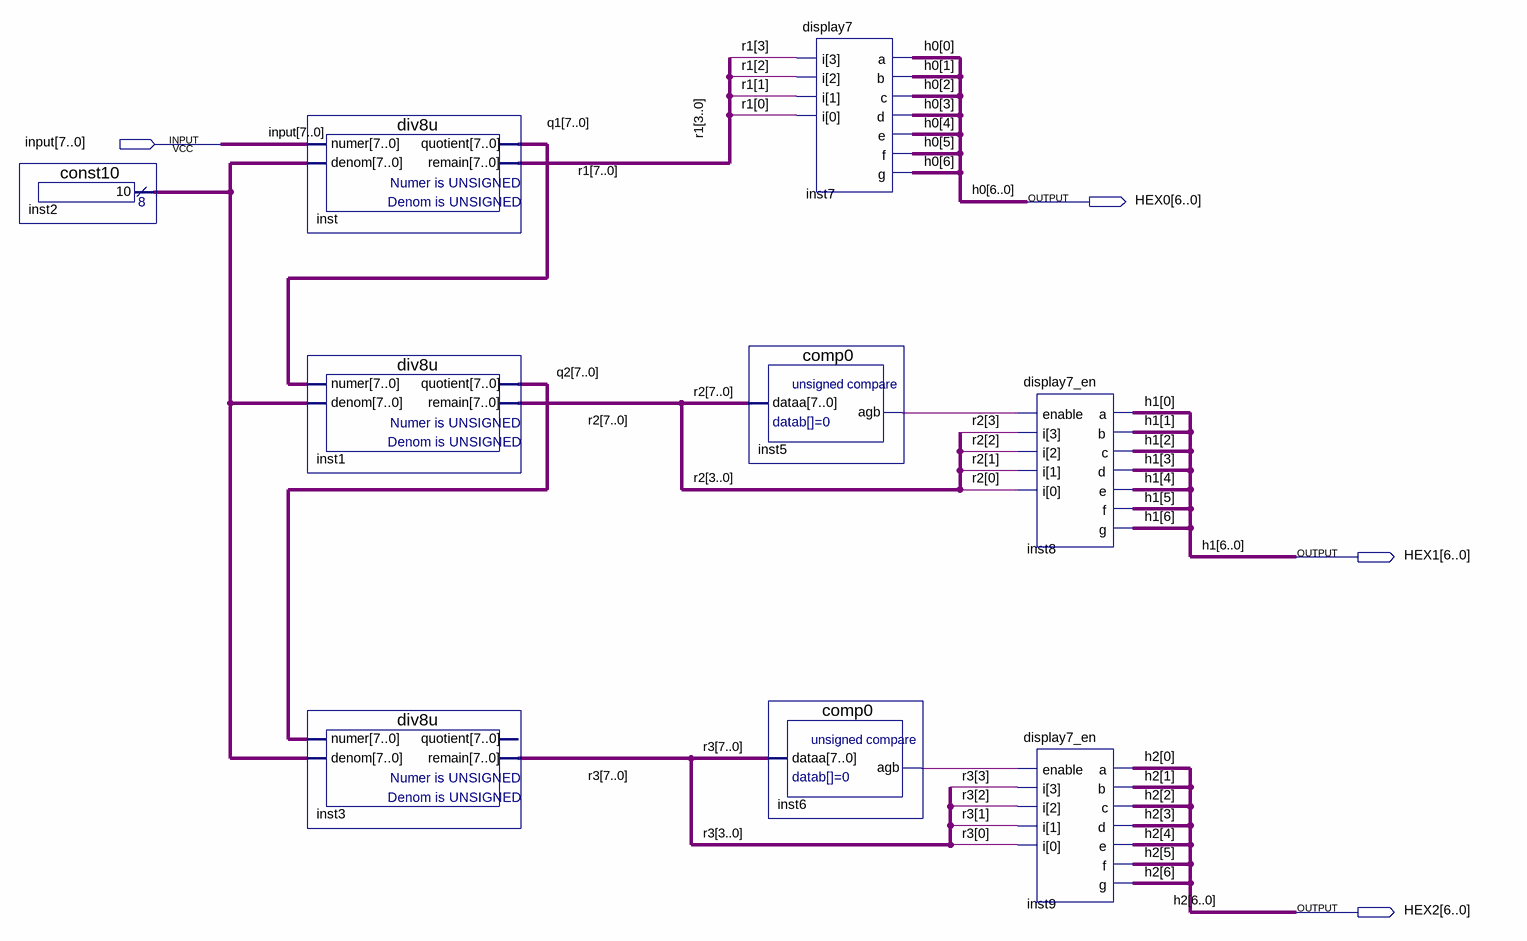
[diagram p0: schematic sheet]
// Quartus schematic display_8bits (2022_05_22 18_19_10 UTC).bdf as structural Verilog: 9 symbols, 4 pins
module \display_8bits_(2022_05_22_18_19_10_UTC)  (
  input  [7:0] \input ,
  output [6:0] HEX0,
  output [6:0] HEX1,
  output [6:0] HEX2
);

  wire inst5_agb, inst6_agb;
  wire [7:0] inst2_result, q1, q2, r1, r2, r3;

  const10 inst2 (.result(inst2_result));
  div8u inst (.numer(\input ), .denom(inst2_result), .quotient(q1), .remain(r1));
  div8u inst1 (.numer(q1), .denom(inst2_result), .quotient(q2), .remain(r2));
  div8u inst3 (.numer(q2), .denom(inst2_result), .remain(r3));  // open: quotient
  display7 inst7 (
    .i(r1[3:0]), .a(HEX0[0]), .b(HEX0[1]), .c(HEX0[2]), .d(HEX0[3]), .e(HEX0[4]), .f(HEX0[5]), .g(HEX0[6]));
  comp0 inst5 (.dataa(r2), .agb(inst5_agb));
  comp0 inst6 (.dataa(r3), .agb(inst6_agb));
  display7_en inst8 (
    .enable(inst5_agb), .i(r2[3:0]), .a(HEX1[0]), .b(HEX1[1]), .c(HEX1[2]), .d(HEX1[3]), .e(HEX1[4]),
    .f(HEX1[5]), .g(HEX1[6]));
  display7_en inst9 (
    .enable(inst6_agb), .i(r3[3:0]), .a(HEX2[0]), .b(HEX2[1]), .c(HEX2[2]), .d(HEX2[3]), .e(HEX2[4]),
    .f(HEX2[5]), .g(HEX2[6]));

  // Other names for the same wires on the sheet: h0[6:0] = HEX0; h1[6:0] = HEX1; h2[6:0] = HEX2
endmodule
